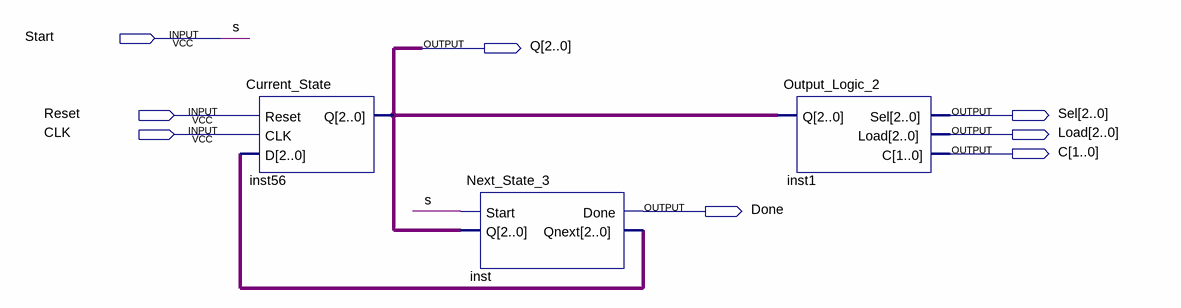
[diagram p0: schematic sheet]
// Quartus schematic Controller_2.bdf as structural Verilog: 3 symbols, 8 pins
module Controller_2 (
  input  Start,
  input  Reset,
  input  CLK,
  output [2:0] Q,
  output [2:0] Sel,
  output [2:0] Load,
  output [1:0] C,
  output Done
);

  wire [2:0] inst_qnext;

  Current_State inst56 (.Reset(Reset), .CLK(CLK), .D(inst_qnext), .Q(Q));
  Next_State_3 inst (.Start(Start), .Q(Q), .Done(Done), .Qnext(inst_qnext));
  Output_Logic_2 inst1 (.Q(Q), .Sel(Sel), .Load(Load), .C(C));

  // Other names for the same wires on the sheet: s = Start
endmodule
